# EAGLE design NixieClockDisplay (EAGLE 8.2.2)
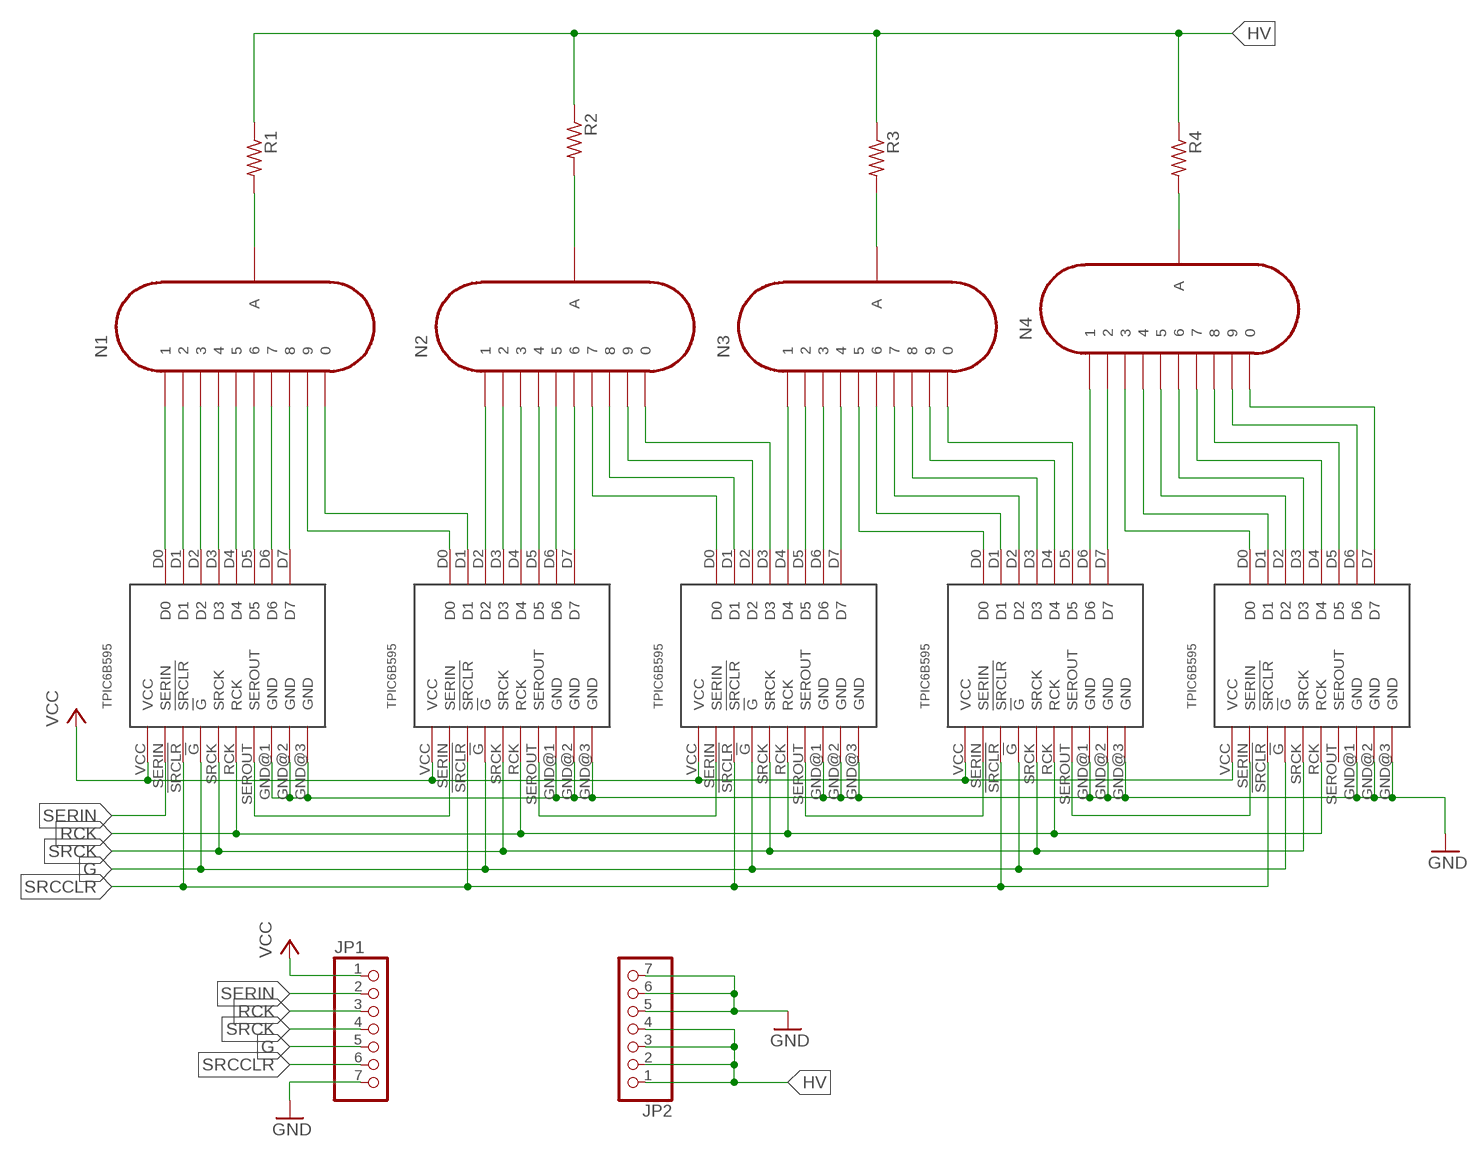
[diagram p0: schematic, sheet 1]

## Parts
JP1  PINHD-1X7  [1X07]
JP2  PINHD-1X7  [1X07]
N1  IN-12A  [IN-12]
N2  IN-12A  [IN-12]
N3  IN-12A  [IN-12]
N4  IN-12A  [IN-12]
R1  R-US_0207/10  [0207/10]
R2  R-US_0207/10  [0207/10]
R3  R-US_0207/10  [0207/10]
R4  R-US_0207/10  [0207/10]
U$1  TPIC6B595  [DIL20]
U$2  TPIC6B595  [DIL20]
U$3  TPIC6B595  [DIL20]
U$4  TPIC6B595  [DIL20]
U$5  TPIC6B595  [DIL20]

## Nets
G: JP1.5 U$1.!G U$2.!G U$3.!G U$4.!G U$5.!G
GND: JP1.7 JP2.5 JP2.6 JP2.7 U$1.GND@1(GND) U$1.GND@2(GND) U$1.GND@3(GND) U$2.GND@1(GND) U$2.GND@2(GND) U$2.GND@3(GND) U$3.GND@1(GND) U$3.GND@2(GND) U$3.GND@3(GND) U$4.GND@1(GND) U$4.GND@2(GND) U$4.GND@3(GND) U$5.GND@1(GND) U$5.GND@2(GND) U$5.GND@3(GND)
HV: JP2.1 JP2.2 JP2.3 JP2.4 R1.1 R2.1 R3.1 R4.1
N$1: N1.A R1.2
N$2: N2.A R2.2
N$3: N3.A R3.2
N$4: N4.A R4.2
N$5: N1.1 U$1.D0
N$6: N1.2 U$1.D1
N$7: N1.3 U$1.D2
N$8: N1.4 U$1.D3
N$9: N1.5 U$1.D4
N$10: N1.6 U$1.D5
N$11: N1.7 U$1.D6
N$12: N1.8 U$1.D7
N$13: N1.9 U$2.D0
N$14: N1.0 U$2.D1
N$15: N2.1 U$2.D2
N$16: N2.2 U$2.D3
N$17: N2.3 U$2.D4
N$18: N2.4 U$2.D5
N$19: N2.5 U$2.D6
N$20: N2.6 U$2.D7
N$21: N2.7 U$3.D0
N$22: N2.8 U$3.D1
N$23: N2.9 U$3.D2
N$24: N2.0 U$3.D3
N$25: N3.1 U$3.D4
N$26: N3.2 U$3.D5
N$27: N3.3 U$3.D6
N$28: N3.4 U$3.D7
N$29: N3.5 U$4.D0
N$30: N3.6 U$4.D1
N$31: N3.7 U$4.D2
N$32: N3.8 U$4.D3
N$33: N3.9 U$4.D4
N$34: N3.0 U$4.D5
N$35: N4.1 U$4.D6
N$36: N4.2 U$4.D7
N$37: N4.3 U$5.D0
N$38: N4.4 U$5.D1
N$39: N4.5 U$5.D2
N$40: N4.6 U$5.D3
N$41: N4.7 U$5.D4
N$42: N4.8 U$5.D5
N$43: N4.9 U$5.D6
N$44: N4.0 U$5.D7
N$45: U$1.SEROUT U$2.SERIN
N$46: U$2.SEROUT U$3.SERIN
N$47: U$3.SEROUT U$4.SERIN
N$50: U$4.SEROUT U$5.SERIN
RCK: JP1.3 U$1.RCK U$2.RCK U$3.RCK U$4.RCK U$5.RCK
SERIN: JP1.2 U$1.SERIN
SRCCLR: JP1.6 U$1.!SRCLR U$2.!SRCLR U$3.!SRCLR U$4.!SRCLR U$5.!SRCLR
SRCK: JP1.4 U$1.SRCK U$2.SRCK U$3.SRCK U$4.SRCK U$5.SRCK
VCC: JP1.1 U$1.VCC U$2.VCC U$3.VCC U$4.VCC U$5.VCC
Unconnected: U$5.SEROUT

## Library data of the parts
JP1 JP2 = pinhead:PINHD-1X7: PIN HEADER
N1-N4 = russian-nixies:IN-12A: IN-12A: medium numeric topview nixie tube
R1-R4 = rcl:R-US_: RESISTOR, American symbol
U$1-U$5 = ShiftRegister:TPIC6B595

## Board
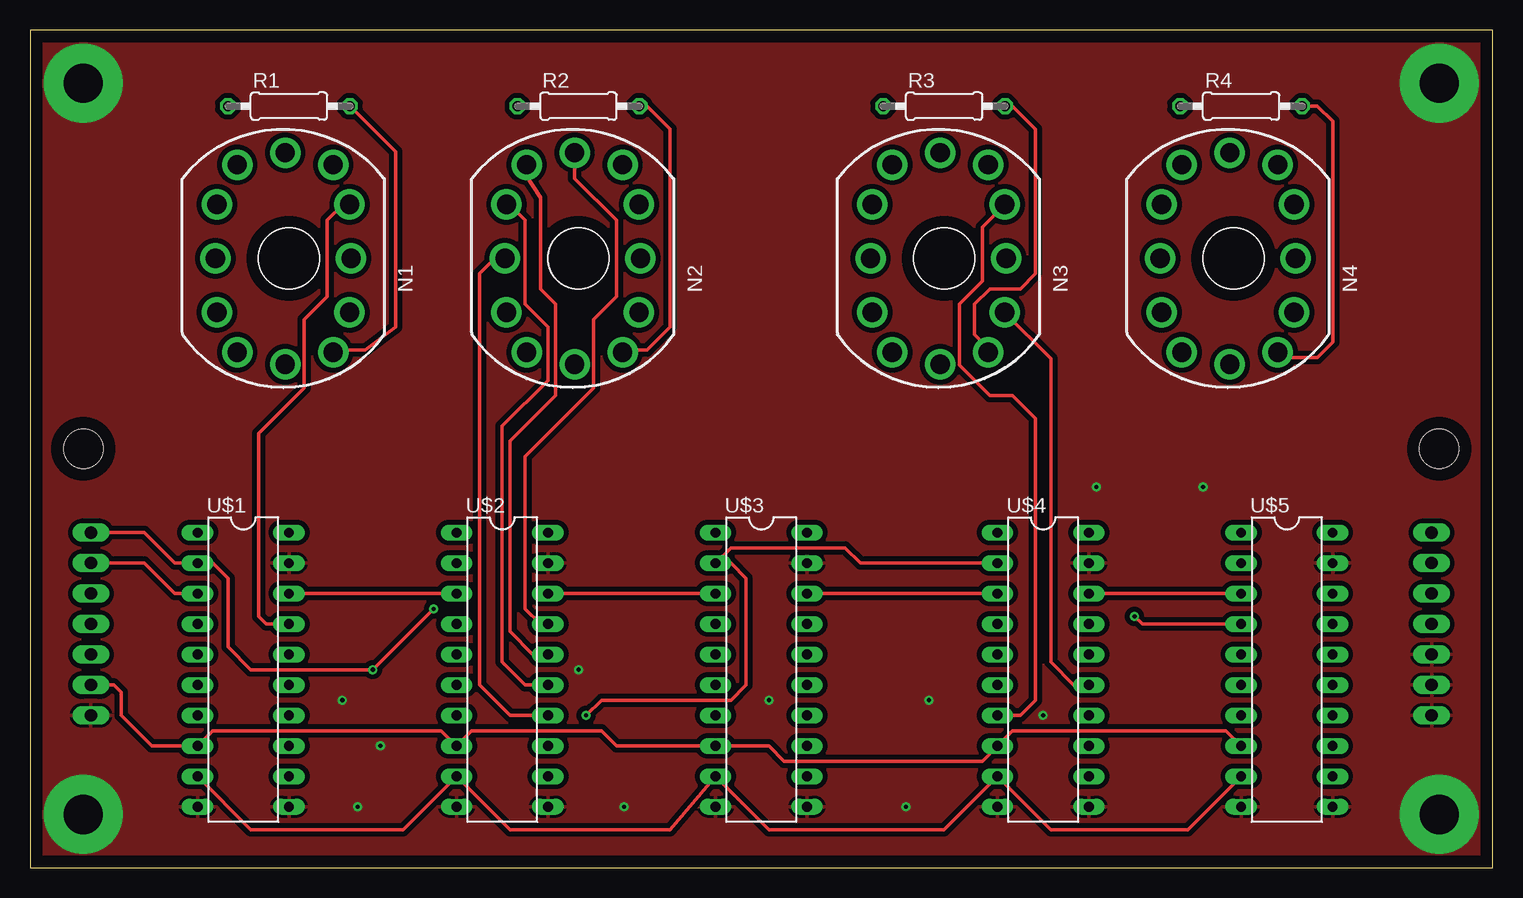
[diagram p1: board, top side]
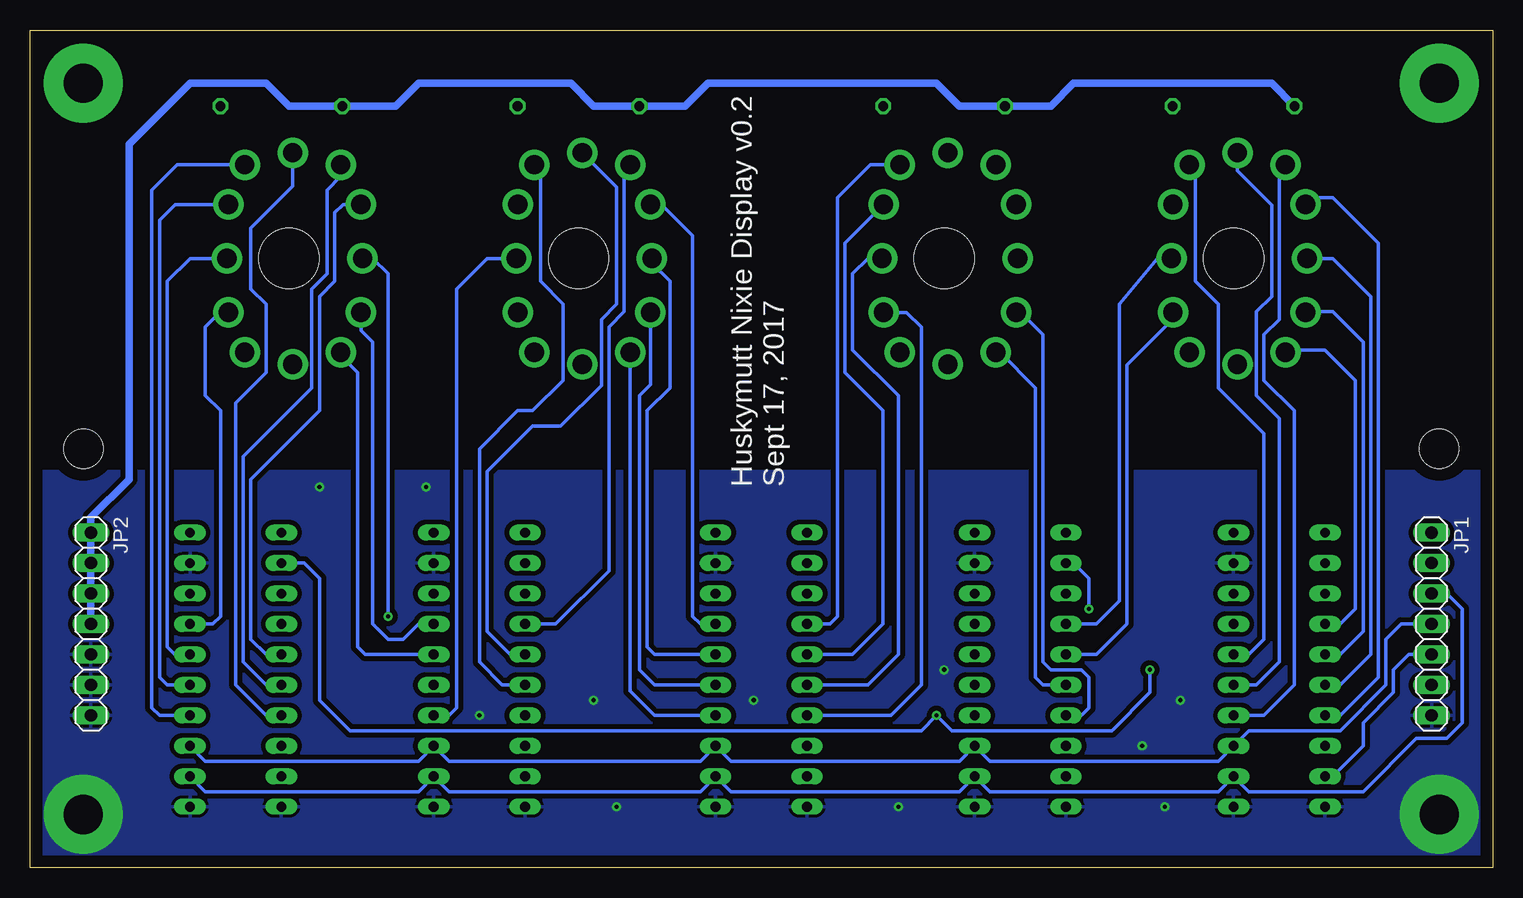
[diagram p2: board, bottom side, seen from below]

Size 121.92 x 69.85 mm. Coordinates in mm from the lower left corner, seen from the top.
Outline: 0,0 121.92,0 121.92,69.85 0,69.85 0,0
Copper layers (1*16): Top 0.035mm / dielectric 1.5mm / Bottom 0.035mm
Design rules "default": minimum track width 6mil, minimum drill 0.35mm, track to track 6mil, track to pad 6mil, pad to pad 6mil, via to via 6mil, smd to smd 6mil, copper to edge 40mil, drill to drill 6mil, minimum pad ring 10mil, minimum via ring 8mil, stop-mask expansion 4mil, vias tented up to drill 0mil, thermal gap 10mil
Holes 3.28 mm at 4.45,34.92 117.47,34.92

### Footprints (pad centres in the part's own frame; a part is rotated, then mirrored left to right if it is on the bottom)
1X07 = drill 1.016 long: 1 -7.62,0; 2 -5.08,0; 3 -2.54,0; 4 0,0; 5 2.54,0; 6 5.08,0; 7 7.62,0
IN-12 = drill 1.6 pad 2.54: 0 5.048,-4.5; 1 -4.317,-7.817; 2 -6,-4.5; 3 -6.127,0; 4 -6,4.5; 5 -4.317,7.817; 6 -0.318,8.818; 7 3.683,7.817; 8 5.048,4.5; 9 5.175,0; A 3.683,-7.817; LHDP -0.318,-8.818 | hole 5: 0,0
0207/10 = drill 0.813 octagon: 1 -5.08,0; 2 5.08,0
DIL20 = drill 0.813 long: !G 8.89,-3.81; !SRCLR 6.35,-3.81; D0 -3.81,-3.81; D1 -1.27,-3.81; D2 1.27,-3.81; D3 3.81,-3.81; D4 3.81,3.81; D5 1.27,3.81; D6 -1.27,3.81; D7 -3.81,3.81; GND@1 11.43,-3.81; GND@2 11.43,3.81; GND@3 -8.89,3.81; NC@1 -11.43,-3.81; NC@2 -11.43,3.81; RCK 8.89,3.81; SERIN -6.35,-3.81; SEROUT -6.35,3.81; SRCK 6.35,3.81; VCC -8.89,-3.81

### Placement (x,y rotation side)
JP1  5.08,20.32 270 bottom
JP2  116.84,20.32 270 bottom
N1  21.59,50.8 0 top
N2  45.72,50.8 0 top
N3  76.2,50.8 0 top
N4  100.33,50.8 0 top
R1  21.59,63.5 0 top
R2  45.72,63.5 0 top
R3  76.2,63.5 0 top
R4  100.97,63.5 0 top
U$1  17.78,16.51 270 top
U$2  39.37,16.51 270 top
U$3  60.96,16.51 270 top
U$4  84.45,16.51 270 top
U$5  104.78,16.51 270 top

### Tracks (layer width: path | path; a pad name or v marks a point on that pad's centre or on a via)
G
  Top 0.305: U$1.!G 18.41,3.17 31.11,3.17 U$2.!G 40.01,3.17 53.34,3.17 U$3.!G 61.59,3.17 76.2,3.17 U$4.!G 85.09,3.17 96.52,3.17 U$5.!G
  Bottom 0.305: U$1.!G 13.34,7.62 10.79,10.16 10.79,12.06 8.26,14.61 8.26,16.51 6.99,17.78 JP1.5
GND  (via drill 0.35, 3.28 pad 6.6)
  other vias: 61.59,13.97 74.93,13.97 84.45,12.7 29.21,10.16 4.45,65.41 117.47,65.41 117.47,4.45 4.45,4.45 27.3,5.08 49.53,5.08 73.03,5.08 45.72,16.51 26.04,13.97 97.79,31.75 88.9,31.75
  pour Bottom (isolate 0.406): 0,0 0,33.02 121.92,33.02 121.92,0
  pour Top (isolate 0.406): 0,70.48 0,0 121.92,0 121.92,70.48
HV
  Bottom 0.61: R1.1 18.41,65.41 34.92,65.41 36.83,63.5 R2.1 44.45,63.5 46.35,65.41 65.41,65.41 67.31,63.5 R3.1 74.93,63.5 76.83,65.41 89.53,65.41 91.44,63.5 R4.1 100.33,63.5 102.23,65.41 108.58,65.41 113.67,60.33 113.67,32.38 116.84,29.21 JP2.1 JP2.2 JP2.3 JP2.4
N$1
  Top 0.305: N1.A 25.47,43.18 27.94,43.18 30.48,45.09 30.48,59.69 R1.2
N$2
  Top 0.305: N2.A 49.6,43.18 51.44,43.18 53.34,45.09 53.34,61.59 51.44,63.5 R2.2
N$3
  Top 0.305: R3.2 81.92,63.5 83.82,61.59 83.82,52.24 | 83.82,52.24 83.82,52.07 | N3.A 79.88,43.31 78.74,44.45 78.74,46.99 80.01,48.26 82.55,48.26 83.82,49.53 83.82,52.24
N$4
  Top 0.305: N4.A 105.08,42.55 107.31,42.55 108.58,43.81 108.58,62.23 107.31,63.5 R4.2
N$5
  Bottom 0.305: U$1.D0 12.7,20.32 11.43,21.59 11.43,40.64 13.97,43.18 17.07,43.18 N1.1
N$6
  Bottom 0.305: U$1.D1 12.7,17.78 10.79,19.68 10.79,43.81 13.34,46.35 14.38,46.35 N1.2
N$7
  Bottom 0.305: U$1.D2 12.7,15.24 10.16,17.78 10.16,47.62 13.34,50.8 N1.3
N$8
  Bottom 0.305: U$1.D3 12.7,12.7 9.53,15.88 9.53,52.07 13.34,55.88 15.01,55.88 N1.4
N$9
  Bottom 0.305: U$1.D4 19.05,12.7 16.51,15.24 16.51,38.1 19.05,40.64 19.05,44.45 17.78,45.72 17.78,58.11 N1.5
N$10
  Bottom 0.305: N1.6 21.27,58.1 18.41,55.24 18.41,47.62 19.68,46.35 19.68,39.37 17.78,37.47 17.78,17.14 19.68,15.24 U$1.D5
N$11
  Bottom 0.305: U$1.D6 20.32,17.78 19.05,19.05 19.05,36.2 22.86,40.01 22.86,46.99 24.77,48.9 24.77,58.42 24.96,58.62 N1.7
N$12
  Top 0.305: U$1.D7 19.68,20.32 19.05,20.95 19.05,36.2 22.86,40.01 22.86,45.72 24.77,47.62 24.77,53.98 26.09,55.3 N1.8
N$13
  Bottom 0.305: U$2.D0 33.02,20.32 31.11,22.23 31.11,46.99 27.94,50.8 N1.9
N$14
  Bottom 0.305: U$2.D1 33.02,17.78 30.48,20.32 30.48,41.91 26.64,45.75 N1.0
N$15
  Bottom 0.305: U$2.D2 37.47,15.24 38.1,15.88 38.1,40.01 41.08,42.98 N2.1
N$16
  Bottom 0.305: U$2.D3 34.29,12.7 33.66,13.34 33.66,15.88 34.29,16.51 36.83,16.51 37.47,17.14 37.47,44.45 39.31,46.3 N2.2
N$17
  Top 0.305: U$2.D4 40.01,12.7 37.47,15.24 37.47,49.53 38.73,50.8 N2.3
N$18
  Top 0.305: U$2.D5 41.27,15.24 39.37,17.14 39.37,36.83 43.18,40.64 43.18,45.09 41.27,46.99 41.27,53.98 39.95,55.3 N2.4
N$19
  Top 0.305: U$2.D6 41.91,17.78 40.01,19.68 40.01,35.56 43.81,39.37 43.81,46.99 42.55,48.26 42.55,55.88 41.4,57.66 N2.5
N$20
  Top 0.305: U$2.D7 42.55,20.32 41.27,21.59 41.27,34.29 46.99,40.01 46.99,45.72 48.9,47.62 48.9,53.98 45.4,57.47 N2.6
N$21
  Bottom 0.305: U$3.D0 55.24,20.32 54.61,20.95 54.61,55.88 51.87,58.62 N2.7
N$22
  Bottom 0.305: U$3.D1 53.34,17.78 50.8,20.32 50.8,38.1 53.98,41.27 53.98,52.07 50.77,55.28 N2.8
N$23
  Bottom 0.305: U$3.D2 52.07,15.24 49.53,17.78 49.53,39.37 53.34,43.18 53.34,49.53 52.07,50.8 N2.9
N$24
  Bottom 0.305: U$3.D3 50.16,12.7 47.62,15.24 47.62,45.09 48.84,46.3 N2.0
N$25
  Bottom 0.305: U$3.D4 69.85,12.7 71.88,14.73 N3.1
N$26
  Bottom 0.305: U$3.D5 69.85,15.24 71.12,16.51 71.12,39.37 70.2,40.29 N3.2
N$27
  Bottom 0.305: U$3.D6 69.85,17.78 70.48,18.41 70.48,38.1 68.58,40.01 68.58,48.9 70.07,50.39 N3.3
N$28
  Bottom 0.305: U$3.D7 66.04,20.32 66.67,20.95 66.67,52.7 69.27,55.3 N3.4
N$29
  Bottom 0.305: N3.5 72.39,58.11 72.39,46.35 73.66,45.09 73.66,24.77 78.11,20.32 U$4.D0
N$30
  Bottom 0.305: N3.6 73.03,56.76 73.03,46.99 74.3,45.72 74.3,40.21 77.67,36.83 80.01,36.83 83.82,33.02 83.82,19.68 81.92,17.78 U$4.D1
N$31
  Bottom 0.305: U$4.D2 82.55,15.24 84.45,17.14 84.45,34.92 81.28,38.1 80.01,38.1 77.47,40.64 77.47,46.99 79.38,48.9 79.38,57.78 79.88,58.29 N3.7
N$32
  Top 0.305: N3.8 79.38,53.43 79.38,48.9 77.47,46.99 77.47,41.91 80.01,39.37 81.92,39.37 83.82,37.47 83.82,13.97 82.55,12.7 U$4.D3
N$33
  Bottom 0.305: U$4.D4 87,12.7 86.36,13.34 86.36,48.26 83.82,50.8 N3.9
N$34
  Top 0.305: N3.0 85.09,42.46 85.09,17.14 87,15.24 U$4.D5
N$35
  Bottom 0.305: U$4.D6 93.98,17.78 94.61,18.41 94.61,41.27 96.32,42.98 N4.1
N$36
  Bottom 0.305: N4.2 94.33,44.8 93.34,43.81 93.34,20.32 92.08,19.05 90.81,19.05 89.53,20.32 U$4.D7
N$37  (via drill 0.35)
  Top 0.305: U$5.D0 92.71,20.32 v92.08,20.95
  Bottom 0.305: v92.08,20.95 92.08,49.53 93.34,50.8 N4.3
N$38
  Bottom 0.305: U$5.D1 102.23,17.78 103.5,19.05 103.5,32.38 97.79,38.1 97.79,47.62 96.52,48.9 96.52,54.61 95.83,55.3 N4.4
N$39
  Bottom 0.305: U$5.D2 102.23,15.24 104.14,17.14 104.14,34.29 98.42,40.01 98.42,48.26 97.16,49.53 97.16,56.52 96.01,57.66 N4.5
N$40
  Bottom 0.305: U$5.D3 102.23,12.7 104.78,15.24 104.78,38.73 102.23,41.27 102.23,46.99 103.5,48.26 103.5,53.34 100.01,56.83 N4.6
N$41
  Bottom 0.305: U$5.D4 111.12,12.7 111.76,13.34 111.76,56.52 109.66,58.62 N4.7
N$42
  Bottom 0.305: U$5.D5 110.49,15.24 111.12,15.88 111.12,53.98 109.8,55.3 N4.8
N$43
  Bottom 0.305: U$5.D6 109.86,17.78 110.49,18.41 110.49,48.9 108.58,50.8 N4.9
N$44
  Bottom 0.305: N4.0 105.43,46.35 106.05,46.35 107.31,45.09 107.31,39.37 106.05,38.1 106.05,20.95 106.68,20.32 U$5.D7
N$45
  Top 0.305: U$1.SEROUT U$2.SERIN
N$46
  Top 0.305: U$2.SEROUT U$3.SERIN
N$47
  Top 0.305: U$3.SEROUT U$4.SERIN
N$50
  Top 0.305: U$4.SEROUT U$5.SERIN
RCK
  Bottom 0.305: U$5.RCK 107.31,6.35 89.53,6.35 U$4.RCK 87,6.35 66.04,6.35 U$3.RCK 63.5,6.35 44.45,6.35 U$2.RCK 41.91,6.35 22.86,6.35 U$1.RCK 20.32,6.35 10.79,6.35 6.35,10.79 3.81,10.79 2.54,12.06 2.54,21.59 3.81,22.86 JP1.3
SERIN
  Top 0.305: JP1.2 9.53,25.4 12.06,22.86 U$1.SERIN
SRCCLR
  Top 0.305: U$5.!SRCLR 99.69,11.43 81.92,11.43 U$4.!SRCLR 79.38,8.89 62.87,8.89 61.59,10.16 U$3.!SRCLR 48.9,10.16 47.62,11.43 36.83,11.43 U$2.!SRCLR 34.29,11.43 15.24,11.43 U$1.!SRCLR 10.16,10.16 7.62,12.7 7.62,14.61 6.99,15.24 JP1.6
SRCK
  Bottom 0.305: U$5.SRCK 107.31,8.89 89.53,8.89 U$4.SRCK 87,8.89 66.04,8.89 U$3.SRCK 63.5,8.89 44.45,8.89 U$2.SRCK 41.91,8.89 22.86,8.89 U$1.SRCK 20.32,11.43 12.7,11.43 8.89,15.24 8.89,19.05 7.62,20.32 JP1.4
VCC  (via drill 0.35)
  Top 0.305: v33.66,21.59 v28.57,16.51 18.41,16.51 16.51,18.41 16.51,24.13 15.24,25.4 U$1.VCC 12.06,25.4 9.53,27.94 JP1.1 | v46.35,12.7 47.62,13.97 58.42,13.97 59.69,15.24 59.69,24.13 58.42,25.4 U$3.VCC 58.42,26.67 67.94,26.67 69.22,25.4 U$4.VCC
  Bottom 0.305: v33.66,21.59 33.66,24.13 34.92,25.4 U$2.VCC | v28.57,16.51 28.57,14.61 31.75,11.43 45.09,11.43 v46.35,12.7 47.62,11.43 95.25,11.43 97.79,13.97 97.79,24.13 99.06,25.4 U$5.VCC

### Text on the board
bPlace: Huskymutt Nixie Display v0.2 / Sept 17, 2017